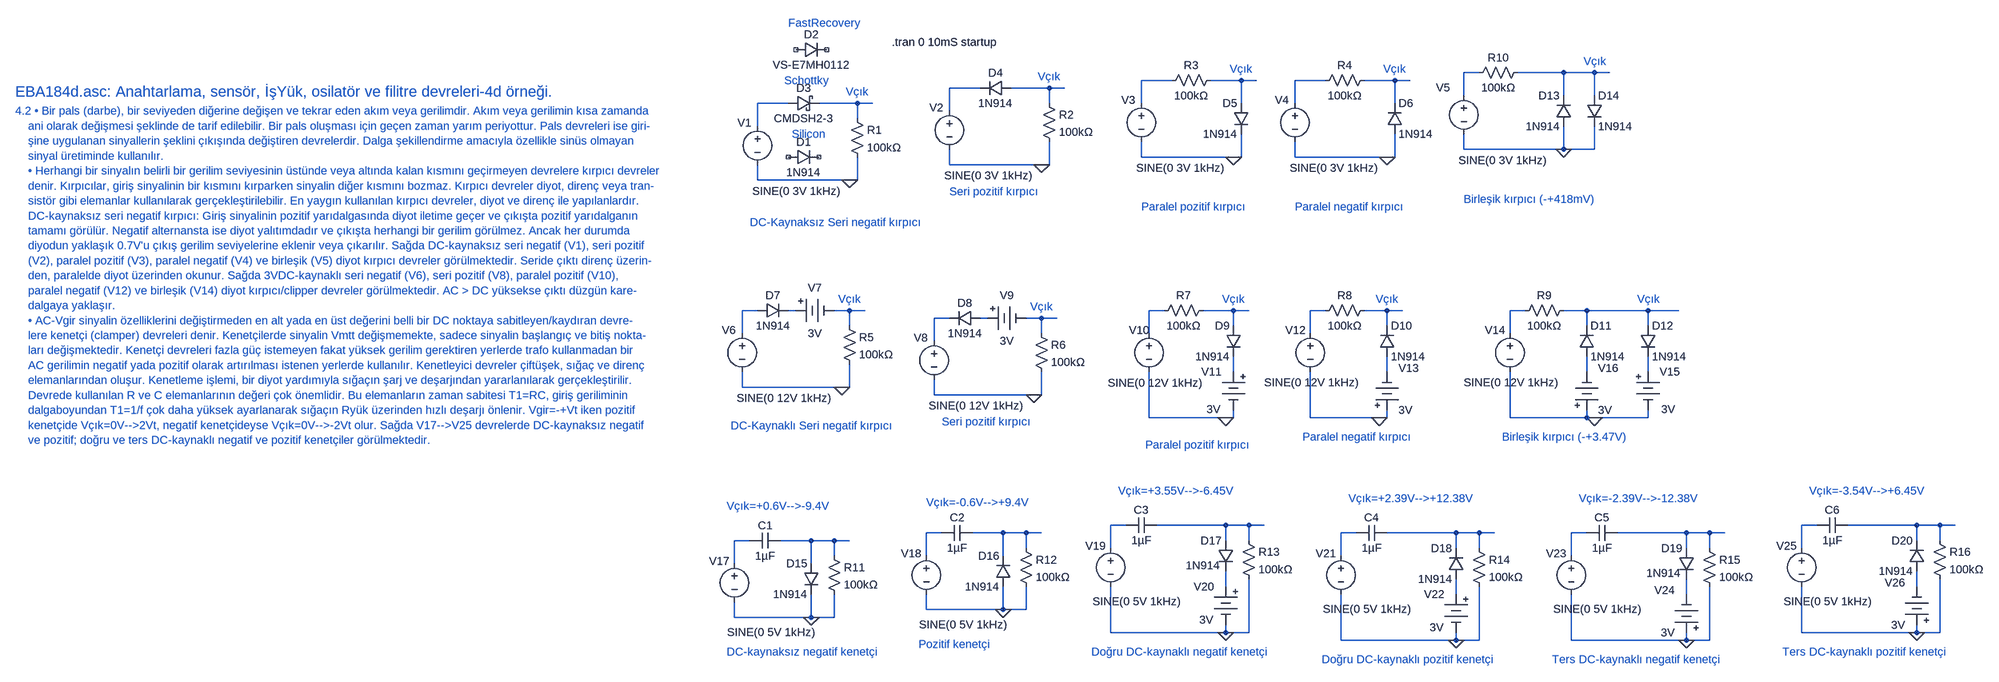
[diagram p0: schematic EBA184d.asc]
EBA184d.asc, the LTspice schematic file:
Version 4
SHEET 1 7064 4332
WIRE 3152 16 3120 16
WIRE 3328 16 3232 16
WIRE 3392 16 3328 16
WIRE 3424 16 3392 16
WIRE 2512 32 2448 32
WIRE 2656 32 2592 32
WIRE 2688 32 2656 32
WIRE 2832 32 2768 32
WIRE 2976 32 2912 32
WIRE 3008 32 2976 32
WIRE 2112 48 2048 48
WIRE 2256 48 2176 48
WIRE 2288 48 2256 48
WIRE 3120 64 3120 16
WIRE 3328 64 3328 16
WIRE 3392 64 3392 16
WIRE 1712 80 1648 80
WIRE 1856 80 1776 80
WIRE 1888 80 1856 80
WIRE 2256 80 2256 48
WIRE 2448 80 2448 32
WIRE 2656 80 2656 32
WIRE 2768 80 2768 32
WIRE 2976 80 2976 32
WIRE 2048 96 2048 48
WIRE 1856 112 1856 80
WIRE 1648 128 1648 80
WIRE 3120 176 3120 144
WIRE 3328 176 3328 128
WIRE 3328 176 3120 176
WIRE 3392 176 3392 128
WIRE 3392 176 3328 176
WIRE 2448 192 2448 160
WIRE 2640 192 2448 192
WIRE 2656 192 2656 144
WIRE 2656 192 2640 192
WIRE 2768 192 2768 160
WIRE 2960 192 2768 192
WIRE 2976 192 2976 144
WIRE 2976 192 2960 192
WIRE 2048 208 2048 176
WIRE 2240 208 2048 208
WIRE 2256 208 2256 160
WIRE 2256 208 2240 208
WIRE 1648 240 1648 208
WIRE 1840 240 1648 240
WIRE 1856 240 1856 192
WIRE 1856 240 1840 240
WIRE 1648 512 1616 512
WIRE 1728 512 1712 512
WIRE 1840 512 1808 512
WIRE 1872 512 1840 512
WIRE 2496 512 2464 512
WIRE 2640 512 2576 512
WIRE 2672 512 2640 512
WIRE 2832 512 2800 512
WIRE 2960 512 2912 512
WIRE 2992 512 2960 512
WIRE 3248 512 3216 512
WIRE 3376 512 3328 512
WIRE 3504 512 3376 512
WIRE 3568 512 3504 512
WIRE 2048 528 2016 528
WIRE 2128 528 2112 528
WIRE 2240 528 2208 528
WIRE 2272 528 2240 528
WIRE 1840 544 1840 512
WIRE 2640 544 2640 512
WIRE 2960 544 2960 512
WIRE 3376 544 3376 512
WIRE 3504 544 3504 512
WIRE 1616 560 1616 512
WIRE 2240 560 2240 528
WIRE 2464 560 2464 512
WIRE 2800 560 2800 512
WIRE 3216 560 3216 512
WIRE 2016 576 2016 528
WIRE 2640 640 2640 608
WIRE 2960 640 2960 608
WIRE 3376 640 3376 608
WIRE 3504 640 3504 608
WIRE 1616 672 1616 640
WIRE 1824 672 1616 672
WIRE 1840 672 1840 624
WIRE 1840 672 1824 672
WIRE 2016 688 2016 656
WIRE 2224 688 2016 688
WIRE 2240 688 2240 640
WIRE 2240 688 2224 688
WIRE 2464 736 2464 640
WIRE 2624 736 2464 736
WIRE 2640 736 2640 720
WIRE 2640 736 2624 736
WIRE 2800 736 2800 640
WIRE 2944 736 2800 736
WIRE 2960 736 2960 720
WIRE 2960 736 2944 736
WIRE 3216 736 3216 640
WIRE 3376 736 3376 720
WIRE 3376 736 3216 736
WIRE 3392 736 3376 736
WIRE 3504 736 3504 720
WIRE 3504 736 3392 736
WIRE 2416 960 2384 960
WIRE 2624 960 2480 960
WIRE 2672 960 2624 960
WIRE 2704 960 2672 960
WIRE 3856 960 3824 960
WIRE 4064 960 3920 960
WIRE 4112 960 4064 960
WIRE 4144 960 4112 960
WIRE 2032 976 2000 976
WIRE 2160 976 2096 976
WIRE 2208 976 2160 976
WIRE 2240 976 2208 976
WIRE 2896 976 2864 976
WIRE 3104 976 2960 976
WIRE 3152 976 3104 976
WIRE 3184 976 3152 976
WIRE 3376 976 3344 976
WIRE 3584 976 3440 976
WIRE 3632 976 3584 976
WIRE 3664 976 3632 976
WIRE 1632 992 1600 992
WIRE 1760 992 1696 992
WIRE 1808 992 1760 992
WIRE 1840 992 1808 992
WIRE 2624 992 2624 960
WIRE 2672 992 2672 960
WIRE 4064 992 4064 960
WIRE 4112 992 4112 960
WIRE 2208 1008 2208 976
WIRE 2384 1008 2384 960
WIRE 3104 1008 3104 976
WIRE 3152 1008 3152 976
WIRE 3584 1008 3584 976
WIRE 3632 1008 3632 976
WIRE 3824 1008 3824 960
WIRE 1808 1024 1808 992
WIRE 2000 1024 2000 976
WIRE 2160 1024 2160 976
WIRE 2864 1024 2864 976
WIRE 3344 1024 3344 976
WIRE 1600 1040 1600 992
WIRE 1760 1040 1760 992
WIRE 2624 1088 2624 1056
WIRE 4064 1088 4064 1056
WIRE 3104 1104 3104 1072
WIRE 3584 1104 3584 1072
WIRE 2000 1136 2000 1104
WIRE 2160 1136 2160 1088
WIRE 2160 1136 2000 1136
WIRE 2208 1136 2208 1088
WIRE 2208 1136 2160 1136
WIRE 1600 1152 1600 1120
WIRE 1760 1152 1760 1104
WIRE 1760 1152 1600 1152
WIRE 1808 1152 1808 1104
WIRE 1808 1152 1760 1152
WIRE 2384 1184 2384 1088
WIRE 2624 1184 2624 1168
WIRE 2624 1184 2384 1184
WIRE 2672 1184 2672 1072
WIRE 2672 1184 2624 1184
WIRE 3824 1184 3824 1088
WIRE 4064 1184 4064 1168
WIRE 4064 1184 3824 1184
WIRE 4112 1184 4112 1072
WIRE 4112 1184 4064 1184
WIRE 2864 1200 2864 1104
WIRE 3104 1200 3104 1184
WIRE 3104 1200 2864 1200
WIRE 3152 1200 3152 1088
WIRE 3152 1200 3104 1200
WIRE 3344 1200 3344 1104
WIRE 3584 1200 3584 1184
WIRE 3584 1200 3344 1200
WIRE 3632 1200 3632 1088
WIRE 3632 1200 3584 1200
FLAG 1840 240 0
FLAG 2240 208 0
FLAG 2640 192 0
FLAG 2960 192 0
FLAG 1824 672 0
FLAG 2224 688 0
FLAG 2624 736 0
FLAG 2944 736 0
FLAG 3392 736 0
FLAG 3328 176 0
FLAG 1760 1152 0
FLAG 2160 1136 0
FLAG 2624 1184 0
FLAG 3104 1200 0
FLAG 3584 1200 0
FLAG 4064 1184 0
SYMBOL voltage 1648 112 R0
WINDOW 0 -42 9 Left 2
WINDOW 3 -11 151 Left 2
WINDOW 123 0 0 Left 0
WINDOW 39 0 0 Left 0
SYMATTR InstName V1
SYMATTR Value SINE(0 3V 1kHz)
SYMBOL diode 1712 208 R270
WINDOW 0 32 32 VTop 2
WINDOW 3 0 32 VBottom 2
SYMATTR InstName D1
SYMATTR Value 1N914
SYMBOL res 1840 96 R0
SYMATTR InstName R1
SYMATTR Value 100kΩ
SYMBOL diode 1728 -16 R270
WINDOW 0 32 32 VTop 2
WINDOW 3 0 32 VBottom 2
SYMATTR InstName D2
SYMATTR Value VS-E7MH0112
SYMBOL schottky 1712 96 R270
WINDOW 0 32 32 VTop 2
WINDOW 3 0 32 VBottom 2
SYMATTR InstName D3
SYMATTR Value CMDSH2-3
SYMATTR Description Diode
SYMATTR Type diode
SYMBOL voltage 2048 80 R0
WINDOW 0 -42 9 Left 2
WINDOW 3 -11 151 Left 2
WINDOW 123 0 0 Left 0
WINDOW 39 0 0 Left 0
SYMATTR InstName V2
SYMATTR Value SINE(0 3V 1kHz)
SYMBOL diode 2176 64 M270
WINDOW 0 32 32 VTop 2
WINDOW 3 0 32 VBottom 2
SYMATTR InstName D4
SYMATTR Value 1N914
SYMBOL res 2240 64 R0
SYMATTR InstName R2
SYMATTR Value 100kΩ
SYMBOL voltage 2448 64 R0
WINDOW 0 -42 9 Left 2
WINDOW 3 -11 151 Left 2
WINDOW 123 0 0 Left 0
WINDOW 39 0 0 Left 0
SYMATTR InstName V3
SYMATTR Value SINE(0 3V 1kHz)
SYMBOL diode 2672 80 M0
SYMATTR InstName D5
SYMATTR Value 1N914
SYMBOL res 2608 16 R90
WINDOW 0 0 56 VBottom 2
WINDOW 3 32 56 VTop 2
SYMATTR InstName R3
SYMATTR Value 100kΩ
SYMBOL voltage 2768 64 R0
WINDOW 0 -42 9 Left 2
WINDOW 3 -11 151 Left 2
WINDOW 123 0 0 Left 0
WINDOW 39 0 0 Left 0
SYMATTR InstName V4
SYMATTR Value SINE(0 3V 1kHz)
SYMBOL diode 2960 144 M180
WINDOW 0 24 64 Left 2
WINDOW 3 24 0 Left 2
SYMATTR InstName D6
SYMATTR Value 1N914
SYMBOL res 2928 16 R90
WINDOW 0 0 56 VBottom 2
WINDOW 3 32 56 VTop 2
SYMATTR InstName R4
SYMATTR Value 100kΩ
SYMBOL voltage 1616 544 R0
WINDOW 0 -42 9 Left 2
WINDOW 3 -11 151 Left 2
WINDOW 123 0 0 Left 0
WINDOW 39 0 0 Left 0
SYMATTR InstName V6
SYMATTR Value SINE(0 12V 1kHz)
SYMBOL diode 1648 528 R270
WINDOW 0 32 32 VTop 2
WINDOW 3 0 32 VBottom 2
SYMATTR InstName D7
SYMATTR Value 1N914
SYMBOL res 1824 528 R0
SYMATTR InstName R5
SYMATTR Value 100kΩ
SYMBOL voltage 2016 560 R0
WINDOW 0 -42 9 Left 2
WINDOW 3 -11 151 Left 2
WINDOW 123 0 0 Left 0
WINDOW 39 0 0 Left 0
SYMATTR InstName V8
SYMATTR Value SINE(0 12V 1kHz)
SYMBOL diode 2112 544 M270
WINDOW 0 32 32 VTop 2
WINDOW 3 0 32 VBottom 2
SYMATTR InstName D8
SYMATTR Value 1N914
SYMBOL res 2224 544 R0
SYMATTR InstName R6
SYMATTR Value 100kΩ
SYMBOL voltage 2464 544 R0
WINDOW 0 -42 9 Left 2
WINDOW 3 -86 119 Left 2
WINDOW 123 0 0 Left 0
WINDOW 39 0 0 Left 0
SYMATTR InstName V10
SYMATTR Value SINE(0 12V 1kHz)
SYMBOL diode 2656 544 M0
SYMATTR InstName D9
SYMATTR Value 1N914
SYMBOL res 2592 496 R90
WINDOW 0 0 56 VBottom 2
WINDOW 3 32 56 VTop 2
SYMATTR InstName R7
SYMATTR Value 100kΩ
SYMBOL voltage 2800 544 R0
WINDOW 0 -52 9 Left 2
WINDOW 3 -96 118 Left 2
WINDOW 123 0 0 Left 0
WINDOW 39 0 0 Left 0
SYMATTR InstName V12
SYMATTR Value SINE(0 12V 1kHz)
SYMBOL diode 2944 608 M180
WINDOW 0 24 64 Left 2
WINDOW 3 24 0 Left 2
SYMATTR InstName D10
SYMATTR Value 1N914
SYMBOL res 2928 496 R90
WINDOW 0 0 56 VBottom 2
WINDOW 3 32 56 VTop 2
SYMATTR InstName R8
SYMATTR Value 100kΩ
SYMBOL Misc\\battery 1712 512 M90
WINDOW 3 32 56 VTop 2
WINDOW 0 -32 56 VBottom 2
SYMATTR Value 3V
SYMATTR InstName V7
SYMBOL Misc\\battery 2112 528 M90
WINDOW 3 32 56 VTop 2
WINDOW 0 -32 56 VBottom 2
SYMATTR Value 3V
SYMATTR InstName V9
SYMBOL Misc\\battery 2640 624 M0
WINDOW 3 27 94 Left 2
SYMATTR Value 3V
SYMATTR InstName V11
SYMBOL Misc\\battery 2960 736 M180
WINDOW 3 24 16 Left 2
WINDOW 0 24 104 Left 2
SYMATTR Value 3V
SYMATTR InstName V13
SYMBOL voltage 3216 544 R0
WINDOW 0 -52 9 Left 2
WINDOW 3 -96 118 Left 2
WINDOW 123 0 0 Left 0
WINDOW 39 0 0 Left 0
SYMATTR InstName V14
SYMATTR Value SINE(0 12V 1kHz)
SYMBOL diode 3360 608 M180
WINDOW 0 24 64 Left 2
WINDOW 3 24 0 Left 2
SYMATTR InstName D11
SYMATTR Value 1N914
SYMBOL res 3344 496 R90
WINDOW 0 0 56 VBottom 2
WINDOW 3 32 56 VTop 2
SYMATTR InstName R9
SYMATTR Value 100kΩ
SYMBOL Misc\\battery 3376 736 M180
WINDOW 3 24 16 Left 2
WINDOW 0 24 104 Left 2
SYMATTR Value 3V
SYMATTR InstName V16
SYMBOL diode 3488 544 R0
SYMATTR InstName D12
SYMATTR Value 1N914
SYMBOL Misc\\battery 3504 624 R0
WINDOW 3 27 94 Left 2
SYMATTR Value 3V
SYMATTR InstName V15
SYMBOL voltage 3120 48 R0
WINDOW 0 -58 -1 Left 2
WINDOW 3 -11 151 Left 2
WINDOW 123 0 0 Left 0
WINDOW 39 0 0 Left 0
SYMATTR InstName V5
SYMATTR Value SINE(0 3V 1kHz)
SYMBOL diode 3344 128 R180
WINDOW 0 24 64 Left 2
WINDOW 3 24 0 Left 2
SYMATTR InstName D13
SYMATTR Value 1N914
SYMBOL res 3248 0 R90
WINDOW 0 0 56 VBottom 2
WINDOW 3 32 56 VTop 2
SYMATTR InstName R10
SYMATTR Value 100kΩ
SYMBOL diode 3376 64 R0
SYMATTR InstName D14
SYMATTR Value 1N914
SYMBOL voltage 1600 1024 R0
WINDOW 0 -53 11 Left 2
WINDOW 3 -15 159 Left 2
WINDOW 123 0 0 Left 0
WINDOW 39 0 0 Left 0
SYMATTR InstName V17
SYMATTR Value SINE(0 5V 1kHz)
SYMBOL diode 1776 1040 M0
SYMATTR InstName D15
SYMATTR Value 1N914
SYMBOL res 1792 1008 R0
SYMATTR InstName R11
SYMATTR Value 100kΩ
SYMBOL cap 1696 976 R90
WINDOW 0 0 32 VBottom 2
WINDOW 3 32 32 VTop 2
SYMATTR InstName C1
SYMATTR Value 1µF
SYMBOL voltage 2000 1008 R0
WINDOW 0 -53 11 Left 2
WINDOW 3 -15 159 Left 2
WINDOW 123 0 0 Left 0
WINDOW 39 0 0 Left 0
SYMATTR InstName V18
SYMATTR Value SINE(0 5V 1kHz)
SYMBOL diode 2176 1088 R180
WINDOW 0 24 64 Left 2
WINDOW 3 24 0 Left 2
SYMATTR InstName D16
SYMATTR Value 1N914
SYMBOL res 2192 992 R0
SYMATTR InstName R12
SYMATTR Value 100kΩ
SYMBOL cap 2096 960 R90
WINDOW 0 0 32 VBottom 2
WINDOW 3 32 32 VTop 2
SYMATTR InstName C2
SYMATTR Value 1µF
SYMBOL voltage 2384 992 R0
WINDOW 0 -53 11 Left 2
WINDOW 3 -38 127 Left 2
WINDOW 123 0 0 Left 0
WINDOW 39 0 0 Left 0
SYMATTR InstName V19
SYMATTR Value SINE(0 5V 1kHz)
SYMBOL diode 2640 992 M0
WINDOW 3 28 52 Left 2
SYMATTR InstName D17
SYMATTR Value 1N914
SYMBOL res 2656 976 R0
SYMATTR InstName R13
SYMATTR Value 100kΩ
SYMBOL cap 2480 944 R90
WINDOW 0 0 32 VBottom 2
WINDOW 3 32 32 VTop 2
SYMATTR InstName C3
SYMATTR Value 1µF
SYMBOL Misc\\battery 2624 1072 M0
WINDOW 3 26 85 Left 2
SYMATTR Value 3V
SYMATTR InstName V20
SYMBOL voltage 2864 1008 R0
WINDOW 0 -53 11 Left 2
WINDOW 3 -38 127 Left 2
WINDOW 123 0 0 Left 0
WINDOW 39 0 0 Left 0
SYMATTR InstName V21
SYMATTR Value SINE(0 5V 1kHz)
SYMBOL diode 3120 1072 R180
WINDOW 0 24 64 Left 2
WINDOW 3 24 0 Left 2
SYMATTR InstName D18
SYMATTR Value 1N914
SYMBOL res 3136 992 R0
SYMATTR InstName R14
SYMATTR Value 100kΩ
SYMBOL cap 2960 960 R90
WINDOW 0 0 32 VBottom 2
WINDOW 3 32 32 VTop 2
SYMATTR InstName C4
SYMATTR Value 1µF
SYMBOL Misc\\battery 3104 1088 M0
WINDOW 3 26 85 Left 2
SYMATTR Value 3V
SYMATTR InstName V22
SYMBOL voltage 3344 1008 R0
WINDOW 0 -53 11 Left 2
WINDOW 3 -38 127 Left 2
WINDOW 123 0 0 Left 0
WINDOW 39 0 0 Left 0
SYMATTR InstName V23
SYMATTR Value SINE(0 5V 1kHz)
SYMBOL diode 3600 1008 M0
WINDOW 3 28 52 Left 2
SYMATTR InstName D19
SYMATTR Value 1N914
SYMBOL res 3616 992 R0
SYMATTR InstName R15
SYMATTR Value 100kΩ
SYMBOL cap 3440 960 R90
WINDOW 0 0 32 VBottom 2
WINDOW 3 32 32 VTop 2
SYMATTR InstName C5
SYMATTR Value 1µF
SYMBOL Misc\\battery 3584 1200 R180
WINDOW 3 24 16 Left 2
WINDOW 0 24 104 Left 2
SYMATTR Value 3V
SYMATTR InstName V24
SYMBOL voltage 3824 992 R0
WINDOW 0 -53 11 Left 2
WINDOW 3 -38 127 Left 2
WINDOW 123 0 0 Left 0
WINDOW 39 0 0 Left 0
SYMATTR InstName V25
SYMATTR Value SINE(0 5V 1kHz)
SYMBOL diode 4080 1056 R180
WINDOW 0 24 64 Left 2
WINDOW 3 24 0 Left 2
SYMATTR InstName D20
SYMATTR Value 1N914
SYMBOL res 4096 976 R0
SYMATTR InstName R16
SYMATTR Value 100kΩ
SYMBOL cap 3920 944 R90
WINDOW 0 0 32 VBottom 2
WINDOW 3 32 32 VTop 2
SYMATTR InstName C6
SYMATTR Value 1µF
SYMBOL Misc\\battery 4064 1184 R180
WINDOW 3 24 16 Left 2
WINDOW 0 24 104 Left 2
SYMATTR Value 3V
SYMATTR InstName V26
TEXT -232 56 Left 3 ;EBA184d.asc: Anahtarlama, sensör, İşYük, osilatör ve filitre devreleri-4d örneği.
TEXT -232 96 Left 2 ;4.2 • Bir pals (darbe), bir seviyeden diğerine değişen ve tekrar eden akım veya gerilimdir. Akım veya gerilimin kısa zamanda \n    ani olarak değişmesi şeklinde de tarif edilebilir. Bir pals oluşması için geçen zaman yarım periyottur. Pals devreleri ise giri-\n    şine uygulanan sinyallerin şeklini çıkışında değiştiren devrelerdir. Dalga şekillendirme amacıyla özellikle sinüs olmayan \n    sinyal üretiminde kullanılır.\n    • Herhangi bir sinyalın belirli bir gerilim seviyesinin üstünde veya altında kalan kısmını geçirmeyen devrelere kırpıcı devreler \n    denir. Kırpıcılar, giriş sinyalinin bir kısmını kırparken sinyalin diğer kısmını bozmaz. Kırpıcı devreler diyot, direnç veya tran-\n    sistör gibi elemanlar kullanılarak gerçekleştirilebilir. En yaygın kullanılan kırpıcı devreler, diyot ve direnç ile yapılanlardır.\n    DC-kaynaksız seri negatif kırpıcı: Giriş sinyalinin pozitif yarıdalgasında diyot iletime geçer ve çıkışta pozitif yarıdalganın \n    tamamı görülür. Negatif alternansta ise diyot yalıtımdadır ve çıkışta herhangi bir gerilim görülmez. Ancak her durumda \n    diyodun yaklaşık 0.7V'u çıkış gerilim seviyelerine eklenir veya çıkarılır. Sağda DC-kaynaksız seri negatif (V1), seri pozitif\n    (V2), paralel pozitif (V3), paralel negatif (V4) ve birleşik (V5) diyot kırpıcı devreler görülmektedir. Seride çıktı direnç üzerin-\n    den, paralelde diyot üzerinden okunur. Sağda 3VDC-kaynaklı seri negatif (V6), seri pozitif (V8), paralel pozitif (V10), \n    paralel negatif (V12) ve birleşik (V14) diyot kırpıcı/clipper devreler görülmektedir. AC > DC yüksekse çıktı düzgün kare-\n    dalgaya yaklaşır.\n    • AC-Vgir sinyalin özelliklerini değiştirmeden en alt yada en üst değerini belli bir DC noktaya sabitleyen/kaydıran devre-\n    lere kenetçi (clamper) devreleri denir. Kenetçilerde sinyalin Vmtt değişmemekte, sadece sinyalin başlangıç ve bitiş nokta-\n    ları değişmektedir. Kenetçi devreleri fazla güç istemeyen fakat yüksek gerilim gerektiren yerlerde trafo kullanmadan bir \n    AC gerilimin negatif yada pozitif olarak artırılması istenen yerlerde kullanılır. Kenetleyici devreler çiftüşek, sığaç ve direnç \n    elemanlarından oluşur. Kenetleme işlemi, bir diyot yardımıyla sığaçın şarj ve deşarjından yararlanılarak gerçekleştirilir.\n    Devrede kullanılan R ve C elemanlarının değeri çok önemlidir. Bu elemanların zaman sabitesi T1=RC, giriş geriliminin \n    dalgaboyundan T1=1/f çok daha yüksek ayarlanarak sığaçın Ryük üzerinden hızlı deşarjı önlenir. Vgir=-+Vt iken pozitif \n    kenetçide Vçık=0V-->2Vt, negatif kenetçideyse Vçık=0V-->-2Vt olur. Sağda V17-->V25 devrelerde DC-kaynaksız negatif\n    ve pozitif; doğru ve ters DC-kaynaklı negatif ve pozitif kenetçiler görülmektedir.
TEXT 1832 56 Left 2 ;Vçık
TEXT 1928 -48 Left 2 !.tran 0 10mS startup
TEXT 1712 -88 Left 2 ;FastRecovery
TEXT 1720 144 Left 2 ;Silicon
TEXT 1704 32 Left 2 ;Schottky
TEXT 1632 328 Left 2 ;DC-Kaynaksız Seri negatif kırpıcı
TEXT 2232 24 Left 2 ;Vçık
TEXT 2048 264 Left 2 ;Seri pozitif kırpıcı
TEXT 2632 8 Left 2 ;Vçık
TEXT 2448 296 Left 2 ;Paralel pozitif kırpıcı
TEXT 2952 8 Left 2 ;Vçık
TEXT 2768 296 Left 2 ;Paralel negatif kırpıcı
TEXT 1816 488 Left 2 ;Vçık
TEXT 1592 752 Left 2 ;DC-Kaynaklı Seri negatif kırpıcı
TEXT 2216 504 Left 2 ;Vçık
TEXT 2032 744 Left 2 ;Seri pozitif kırpıcı
TEXT 2616 488 Left 2 ;Vçık
TEXT 2456 792 Left 2 ;Paralel pozitif kırpıcı
TEXT 2936 488 Left 2 ;Vçık
TEXT 2784 776 Left 2 ;Paralel negatif kırpıcı
TEXT 3200 776 Left 2 ;Birleşik kırpıcı (-+3.47V)
TEXT 3528 488 Right 2 ;Vçık
TEXT 3120 280 Left 2 ;Birleşik kırpıcı (-+418mV)
TEXT 3416 -8 Right 2 ;Vçık
TEXT 2000 912 Left 2 ;Vçık=-0.6V-->+9.4V
TEXT 1584 1224 Left 2 ;DC-kaynaksız negatif kenetçi
TEXT 1984 1208 Left 2 ;Pozitif kenetçi
TEXT 1584 920 Left 2 ;Vçık=+0.6V-->-9.4V
TEXT 2344 1224 Left 2 ;Doğru DC-kaynaklı negatif kenetçi
TEXT 2400 888 Left 2 ;Vçık=+3.55V-->-6.45V
TEXT 2824 1240 Left 2 ;Doğru DC-kaynaklı pozitif kenetçi
TEXT 2880 904 Left 2 ;Vçık=+2.39V-->+12.38V
TEXT 3304 1240 Left 2 ;Ters DC-kaynaklı negatif kenetçi
TEXT 3360 904 Left 2 ;Vçık=-2.39V-->-12.38V
TEXT 3784 1224 Left 2 ;Ters DC-kaynaklı pozitif kenetçi
TEXT 3840 888 Left 2 ;Vçık=-3.54V-->+6.45V

The netlist it stands for:
* EBA184d.asc
V1 N009 0 SINE(0 3V 1kHz)
D1 NC_01 NC_02 1N914
R1 N010 0 100kΩ
D2 NC_03 NC_04 VS-E7MH0112
D3 N009 N010 CMDSH2-3
V2 N007 0 SINE(0 3V 1kHz)
D4 N008 N007 1N914
R2 N008 0 100kΩ
V3 N003 0 SINE(0 3V 1kHz)
D5 N004 0 1N914
R3 N004 N003 100kΩ
V4 N005 0 SINE(0 3V 1kHz)
D6 0 N006 1N914
R4 N006 N005 100kΩ
V6 N011 0 SINE(0 12V 1kHz)
D7 N011 N012 1N914
R5 N013 0 100kΩ
V8 N020 0 SINE(0 12V 1kHz)
D8 N021 N020 1N914
R6 N022 0 100kΩ
V10 N014 0 SINE(0 12V 1kHz)
D9 N015 N023 1N914
R7 N015 N014 100kΩ
V12 N016 0 SINE(0 12V 1kHz)
D10 N024 N017 1N914
R8 N017 N016 100kΩ
V7 N012 N013 3V
V9 N021 N022 3V
V11 N023 0 3V
V13 0 N024 3V
V14 N018 0 SINE(0 12V 1kHz)
D11 N025 N019 1N914
R9 N019 N018 100kΩ
V16 0 N025 3V
D12 N019 N026 1N914
V15 N026 0 3V
V5 N001 0 SINE(0 3V 1kHz)
D13 0 N002 1N914
R10 N002 N001 100kΩ
D14 N002 0 1N914
V17 N037 0 SINE(0 5V 1kHz)
D15 N038 0 1N914
R11 N038 0 100kΩ
C1 N038 N037 1µF
V18 N031 0 SINE(0 5V 1kHz)
D16 0 N032 1N914
R12 N032 0 100kΩ
C2 N032 N031 1µF
V19 N027 0 SINE(0 5V 1kHz)
D17 N028 N039 1N914
R13 N028 0 100kΩ
C3 N028 N027 1µF
V20 N039 0 3V
V21 N033 0 SINE(0 5V 1kHz)
D18 N041 N034 1N914
R14 N034 0 100kΩ
C4 N034 N033 1µF
V22 N041 0 3V
V23 N035 0 SINE(0 5V 1kHz)
D19 N036 N042 1N914
R15 N036 0 100kΩ
C5 N036 N035 1µF
V24 0 N042 3V
V25 N029 0 SINE(0 5V 1kHz)
D20 N040 N030 1N914
R16 N030 0 100kΩ
C6 N030 N029 1µF
V26 0 N040 3V
.model D D
.lib standard.dio
* EBA184d.asc: Anahtarlama, sensör, İşYük, osilatör ve filitre devreleri-4d örneği.
* 4.2 • Bir pals (darbe), bir seviyeden diğerine değişen ve tekrar eden akım veya gerilimdir. Akım veya gerilimin kısa zamanda
*     ani olarak değişmesi şeklinde de tarif edilebilir. Bir pals oluşması için geçen zaman yarım periyottur. Pals devreleri ise giri-
*     şine uygulanan sinyallerin şeklini çıkışında değiştiren devrelerdir. Dalga şekillendirme amacıyla özellikle sinüs olmayan
*     sinyal üretiminde kullanılır.
*     • Herhangi bir sinyalın belirli bir gerilim seviyesinin üstünde veya altında kalan kısmını geçirmeyen devrelere kırpıcı devreler
*     denir. Kırpıcılar, giriş sinyalinin bir kısmını kırparken sinyalin diğer kısmını bozmaz. Kırpıcı devreler diyot, direnç veya tran-
*     sistör gibi elemanlar kullanılarak gerçekleştirilebilir. En yaygın kullanılan kırpıcı devreler, diyot ve direnç ile yapılanlardır.
*     DC-kaynaksız seri negatif kırpıcı: Giriş sinyalinin pozitif yarıdalgasında diyot iletime geçer ve çıkışta pozitif yarıdalganın
*     tamamı görülür. Negatif alternansta ise diyot yalıtımdadır ve çıkışta herhangi bir gerilim görülmez. Ancak her durumda
*     diyodun yaklaşık 0.7V'u çıkış gerilim seviyelerine eklenir veya çıkarılır. Sağda DC-kaynaksız seri negatif (V1), seri pozitif
*     (V2), paralel pozitif (V3), paralel negatif (V4) ve birleşik (V5) diyot kırpıcı devreler görülmektedir. Seride çıktı direnç üzerin-
*     den, paralelde diyot üzerinden okunur. Sağda 3VDC-kaynaklı seri negatif (V6), seri pozitif (V8), paralel pozitif (V10),
*     paralel negatif (V12) ve birleşik (V14) diyot kırpıcı/clipper devreler görülmektedir. AC > DC yüksekse çıktı düzgün kare-
*     dalgaya yaklaşır.
*     • AC-Vgir sinyalin özelliklerini değiştirmeden en alt yada en üst değerini belli bir DC noktaya sabitleyen/kaydıran devre-
*     lere kenetçi (clamper) devreleri denir. Kenetçilerde sinyalin Vmtt değişmemekte, sadece sinyalin başlangıç ve bitiş nokta-
*     ları değişmektedir. Kenetçi devreleri fazla güç istemeyen fakat yüksek gerilim gerektiren yerlerde trafo kullanmadan bir
*     AC gerilimin negatif yada pozitif olarak artırılması istenen yerlerde kullanılır. Kenetleyici devreler çiftüşek, sığaç ve direnç
*     elemanlarından oluşur. Kenetleme işlemi, bir diyot yardımıyla sığaçın şarj ve deşarjından yararlanılarak gerçekleştirilir.
*     Devrede kullanılan R ve C elemanlarının değeri çok önemlidir. Bu elemanların zaman sabitesi T1=RC, giriş geriliminin
*     dalgaboyundan T1=1/f çok daha yüksek ayarlanarak sığaçın Ryük üzerinden hızlı deşarjı önlenir. Vgir=-+Vt iken pozitif
*     kenetçide Vçık=0V-->2Vt, negatif kenetçideyse Vçık=0V-->-2Vt olur. Sağda V17-->V25 devrelerde DC-kaynaksız negatif
*     ve pozitif; doğru ve ters DC-kaynaklı negatif ve pozitif kenetçiler görülmektedir.
* Vçık
.tran 0 10mS startup
* FastRecovery
* Silicon
* Schottky
* DC-Kaynaksız Seri negatif kırpıcı
* Vçık
* Seri pozitif kırpıcı
* Vçık
* Paralel pozitif kırpıcı
* Vçık
* Paralel negatif kırpıcı
* Vçık
* DC-Kaynaklı Seri negatif kırpıcı
* Vçık
* Seri pozitif kırpıcı
* Vçık
* Paralel pozitif kırpıcı
* Vçık
* Paralel negatif kırpıcı
* Birleşik kırpıcı (-+3.47V)
* Vçık
* Birleşik kırpıcı (-+418mV)
* Vçık
* Vçık=-0.6V-->+9.4V
* DC-kaynaksız negatif kenetçi
* Pozitif kenetçi
* Vçık=+0.6V-->-9.4V
* Doğru DC-kaynaklı negatif kenetçi
* Vçık=+3.55V-->-6.45V
* Doğru DC-kaynaklı pozitif kenetçi
* Vçık=+2.39V-->+12.38V
* Ters DC-kaynaklı negatif kenetçi
* Vçık=-2.39V-->-12.38V
* Ters DC-kaynaklı pozitif kenetçi
* Vçık=-3.54V-->+6.45V
.backanno
.end